# Altium schematic sheet Interface.SchDoc
size A4; SheetNumber: 3; SheetTotal: 3
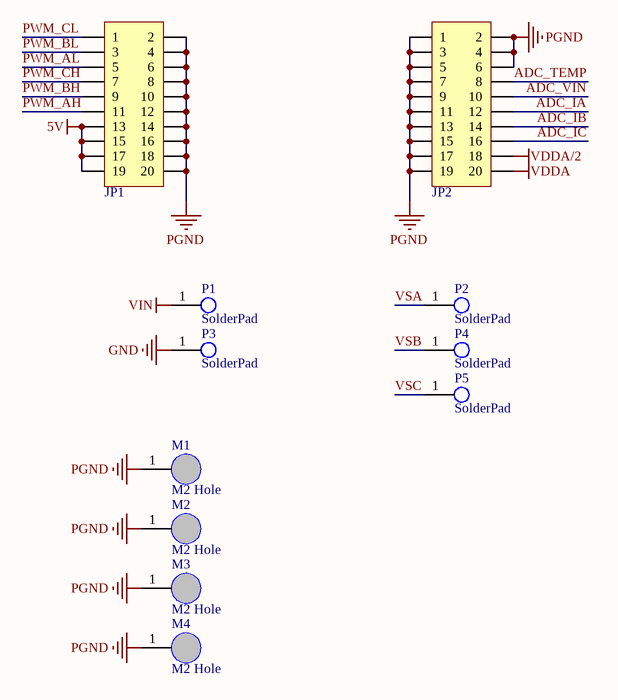
[diagram p0: Interface.SchDoc]

## Parts
JP1  Header 2X10  [HDR2.0-LI-2x10P]  (value not drawn)
JP2  Header 2X10  [HDR2.0-LI-2x10P]  (value not drawn)
M1  M2 Hole  [M2 Hole]
M2  M2 Hole  [M2 Hole]
M3  M2 Hole  [M2 Hole]
M4  M2 Hole  [M2 Hole]
P1  SolderPad  [SolderPad]
P2  SolderPad  [SolderPad]
P3  SolderPad  [SolderPad]
P4  SolderPad  [SolderPad]
P5  SolderPad  [SolderPad]

## Nets
5V: JP1.13 JP1.15 JP1.17 JP1.19
GND: P3.1(SolderPad)
PGND: JP1.2 JP1.4 JP1.6 JP1.8 JP1.10 JP1.12 JP1.14 JP1.16 JP1.18 JP1.20 JP2.1 JP2.2 JP2.3 JP2.4 JP2.5 JP2.6 JP2.7 JP2.9 JP2.11 JP2.13 JP2.15 JP2.17 JP2.19 M1.1(Hole) M2.1(Hole) M3.1(Hole) M4.1(Hole)
VDDA: JP2.20
VDDA/2: JP2.18
VIN: P1.1(SolderPad)
ADC_IA: JP2.12
ADC_IB: JP2.14
ADC_IC: JP2.16
ADC_TEMP: JP2.8
ADC_VIN: JP2.10
PWM_AH: JP1.11
PWM_AL: JP1.5
PWM_BH: JP1.9
PWM_BL: JP1.3
PWM_CH: JP1.7
PWM_CL: JP1.1
VSA: P2.1(SolderPad)
VSB: P4.1(SolderPad)
VSC: P5.1(SolderPad)

## Library data of the parts
JP1 JP2 = Header 10X2: 10*2P接插件; 封装库来自淘宝卖家 ID：黄晶宝石: 其他店铺购入均为盗版假冒封装库; 联系卖家，免费查找封装: 唯一出售店铺网址https://shop463601444.taobao.com; BOM名称: 10*2P接插件
M1-M4 = M2_hole
P1-P5 = SolderPad: 焊盘